# Altium project Collecteur.PrjPcb
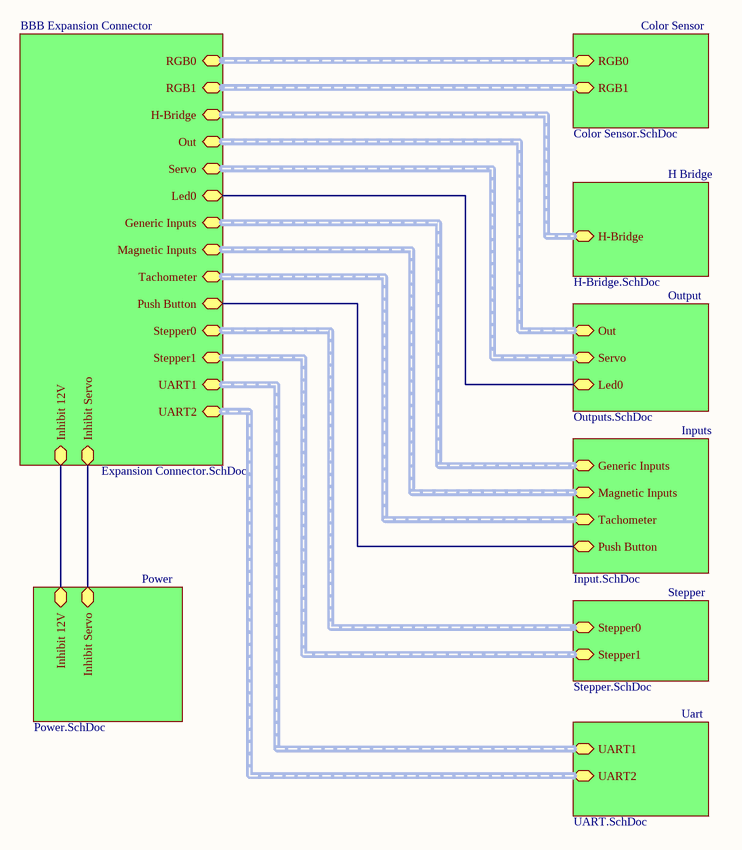
[diagram p0: Top.SchDoc]
5 sheets, 143 parts. Net scope: hierarchical (ports join the sheet entries above them; power ports are global).
Board file: Collecteur.PcbDoc
Sheets:
  Top.SchDoc
    Color Sensor = Color Sensor.SchDoc
    Stepper = Stepper.SchDoc
    Output = Outputs.SchDoc
    H Bridge = H-Bridge.SchDoc

## Sheet Top.SchDoc
size A4

### Sub-sheets
BBB Expansion Connector = Expansion Connector.SchDoc (file not in this document): Out (harness Outputs), Generic Inputs (harness Generic Inputs), RGB0 (harness RGB), H-Bridge (harness H-Bridge), RGB1 (harness RGB), Stepper0 (harness Stepper), Stepper1 (harness Stepper), Servo (harness Servo), Magnetic Inputs (harness Magnetic Inputs), Inhibit 12V, Inhibit Servo, Push Button, Tachometer (harness Tachometer), Led0, UART1 (harness Serial), UART2 (harness Serial)
Color Sensor = Color Sensor.SchDoc: RGB0 (harness RGB), RGB1 (harness RGB)
H Bridge = H-Bridge.SchDoc: H-Bridge (harness H-Bridge)
Inputs = Input.SchDoc (file not in this document): Generic Inputs (harness Generic Inputs), Magnetic Inputs (harness Magnetic Inputs), Push Button, Tachometer (harness Tachometer)
Output = Outputs.SchDoc: Out (harness Outputs), Servo (harness Servo), Led0
Power = Power.SchDoc (file not in this document): Inhibit 12V, Inhibit Servo
Stepper = Stepper.SchDoc: Stepper0 (harness Stepper), Stepper1 (harness Stepper)
Uart = UART.SchDoc (file not in this document): UART1 (harness Serial), UART2 (harness Serial)

### Nets
NetR99_1: sheet BBB Expansion Connector/Led0, sheet Output/Led0
(unnamed): sheet BBB Expansion Connector/Inhibit 12V, sheet Power/Inhibit 12V
(unnamed): sheet BBB Expansion Connector/Inhibit Servo, sheet Power/Inhibit Servo
(unnamed): sheet BBB Expansion Connector/Push Button, sheet Inputs/Push Button

### Buses and harness runs
harness sheet BBB Expansion Connector/Generic Inputs = sheet Inputs/Generic Inputs
harness sheet BBB Expansion Connector/H-Bridge = sheet H Bridge/H-Bridge
harness sheet BBB Expansion Connector/Magnetic Inputs = sheet Inputs/Magnetic Inputs
harness sheet BBB Expansion Connector/Out = sheet Output/Out
harness sheet BBB Expansion Connector/RGB0 = sheet Color Sensor/RGB0
harness sheet BBB Expansion Connector/RGB1 = sheet Color Sensor/RGB1
harness sheet BBB Expansion Connector/Servo = sheet Output/Servo
harness sheet BBB Expansion Connector/Stepper0 = sheet Stepper/Stepper0
harness sheet BBB Expansion Connector/Stepper1 = sheet Stepper/Stepper1
harness sheet BBB Expansion Connector/Tachometer = sheet Inputs/Tachometer
harness sheet BBB Expansion Connector/UART1 = sheet Uart/UART1
harness sheet BBB Expansion Connector/UART2 = sheet Uart/UART2

## Sheet Color Sensor.SchDoc
size A4
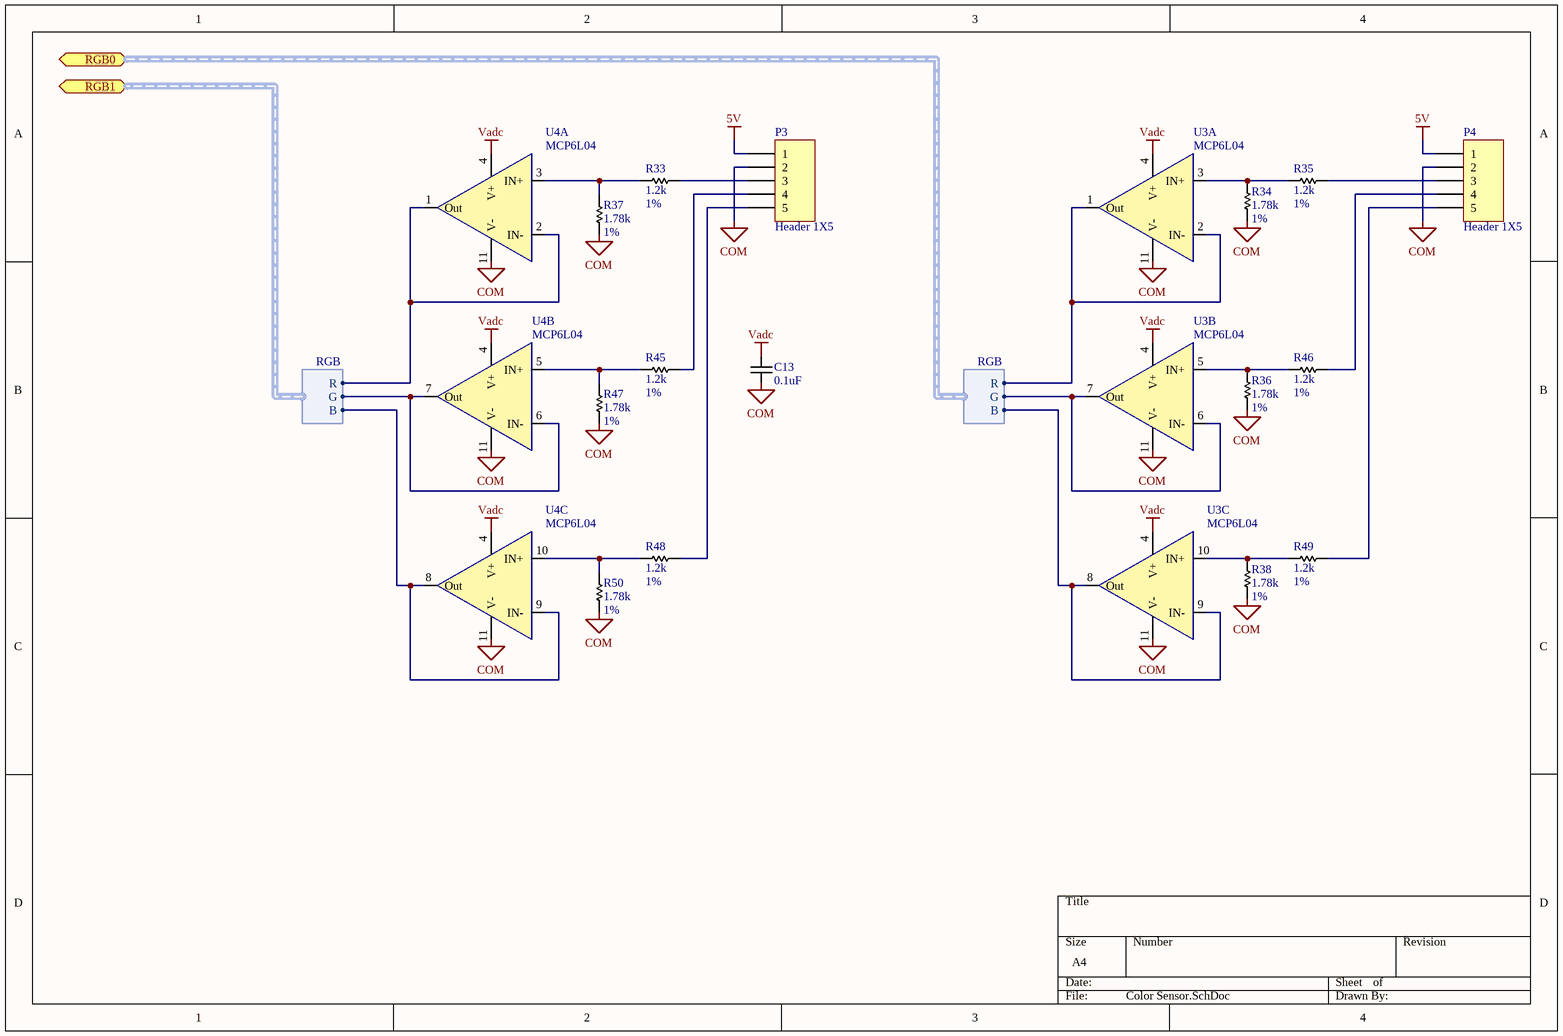
[diagram p1: Color Sensor.SchDoc]

### Parts
C13  value 0.1uF  [0805 - Cap Non-Polarized]  (hidden comment: Cap)
P3  Header 1X5  [Headers - 1x5 - Vertical - Lock]
P4  Header 1X5  [Headers - 1x5 - Vertical - Lock]
R33  value 1.2k  Tolerance: 1%  [0805 - Resistor]  (hidden comment: Res)
R34  value 1.78k  Tolerance: 1%  [0805 - Resistor]  (hidden comment: Res)
R35  value 1.2k  Tolerance: 1%  [0805 - Resistor]  (hidden comment: Res)
R36  value 1.78k  Tolerance: 1%  [0805 - Resistor]  (hidden comment: Res)
R37  value 1.78k  Tolerance: 1%  [0805 - Resistor]  (hidden comment: Res)
R38  value 1.78k  Tolerance: 1%  [0805 - Resistor]  (hidden comment: Res)
R45  value 1.2k  Tolerance: 1%  [0805 - Resistor]  (hidden comment: Res)
R46  value 1.2k  Tolerance: 1%  [0805 - Resistor]  (hidden comment: Res)
R47  value 1.78k  Tolerance: 1%  [0805 - Resistor]  (hidden comment: Res)
R48  value 1.2k  Tolerance: 1%  [0805 - Resistor]  (hidden comment: Res)
R49  value 1.2k  Tolerance: 1%  [0805 - Resistor]  (hidden comment: Res)
R50  value 1.78k  Tolerance: 1%  [0805 - Resistor]  (hidden comment: Res)
U3  MCP6L04  [SOIC14 - 0.150]  (parts A,B,C of 4)
U4  MCP6L04  [SOIC14 - 0.150]  (parts A,B,C of 4)

### Ports
RGB0 (harness RGB), RGB1 (harness RGB)

### Harnesses
RGB: R, G, B

### Nets
5V: P3.1 P4.1
COM: C13.2 P3.2 P4.2 R34.2 R36.2 R37.2 R38.2 R47.2 R50.2 U3.11(V-) U4.11(V-)
Vadc: C13.1 U3.4(V+) U4.4(V+)
NetP3_3: P3.3 R33.1
NetP3_4: P3.4 R45.1
NetP3_5: P3.5 R48.1
NetP4_3: P4.3 R35.1
NetP4_4: P4.4 R46.1
NetP4_5: P4.5 R49.1
NetR33_2: R33.2 R37.1 U4.3(IN+)
NetR34_1: R34.1 R35.2 U3.3(IN+)
NetR36_1: R36.1 R46.2 U3.5(IN+)
NetR38_1: R38.1 R49.2 U3.10(IN+)
NetR45_2: R45.2 R47.1 U4.5(IN+)
NetR48_2: R48.2 R50.1 U4.10(IN+)
NetU3_1: U3.1(Out) U3.2(IN-) ; port RGB0.R
NetU3_6: U3.6(IN-) U3.7(Out) ; port RGB0.G
NetU3_8: U3.8(Out) U3.9(IN-) ; port RGB0.B
NetU4_1: U4.1(Out) U4.2(IN-) ; port RGB1.R
NetU4_6: U4.6(IN-) U4.7(Out) ; port RGB1.G
NetU4_8: U4.8(Out) U4.9(IN-) ; port RGB1.B

### Library data of the parts
C13 = Cap-TDK-CGA-0.1uF-0805: CAP CER 0.1UF 100V 10% X7R 0805; Manufacturer: TDK; Manufacturer No: CGA4J2X7R2A104K125AA; Sub Category: 0805; Part Number: Cap-TDK-CGA-0.1uF-0805; Category: Capacitor; Pin count: 2; Package: 0805; Series: CGA; Supplier 1: Digi-Key; Supplier Part Number 1: 445-5827-1-ND; ComponentLink1URL: http://product.tdk.com/capacitor/mlcc/en/documents/mlcc_automotive_midvoltage_en.pdf; ComponentLink1Description: Datasheet; Creation Date: 2013-09-19 19:23:33; Created by: Pier-Yves; Tolerance: 10%; Height: 1.45mm; Voltage: 100V; Temperature: -55°C ~ 125°C
P3 P4 = Header-0.100-Vertical-Lock-1X5: CONN HEADER 5POS .100" STR TIN; Manufacturer: Molex Inc; Manufacturer No: 90136-1105; Sub Category: 100mils Vertical lock; Value: 5 pins; LatestRevisionDate: 17-Jul-2002; LatestRevisionNote: Re-released for DXP Platform.; Publisher: Altium Limited; Part Number: Header-0.100-Vertical-Lock-1X5; Category: Header; Pin count: 5; Series: C-Grid III 90136; Supplier 1: Digi-Key; Supplier Part Number 1: WM8216-ND; ComponentLink1URL: http://www.molex.com/pdm_docs/sd/901361105_sd.pdf; ComponentLink1Description: Datasheet; Creation Date: 2013-11-05 17:17:54; Created by: Pier-Yves; Height: 10.9mm
R33 R35 R45 R46 R48 R49 = Yagao-RC0805-1%-1.2k: RES 1.20K OHM 1/8W 1% 0805 SMD; Manufacturer: Yagao; Manufacturer No: RC0805FR-071K2L; Part Number: Yagao-RC0805-1%-1.2k; Category: Resistor; Sub Category: 0805 - 1%; Pin count: 2; Package: 0805; Series: RC0805; Supplier 1: Digi-Key; Supplier Part Number 1: 311-1.20KCRCT-ND; ComponentLink1URL: http://media.digikey.com/pdf/Data%20Sheets/Yageo%20PDFs/RC0805%20Pb%20Free.pdf; ComponentLink1Description: Datasheet; Creation Date: 2013-11-05 13:43:35; Created by: Pier-Yves; Power: 1/8W; Height: 0.6mm
R34 R36-R38 R47 R50 = Yagao-RC0805-1%-1.78k: RES 1.78K OHM 1/8W 1% 0805 SMD; Manufacturer: Yagao; Manufacturer No: RC0805FR-071K78L; Part Number: Yagao-RC0805-1%-1.78k; Category: Resistor; Sub Category: 0805 - 1%; Pin count: 2; Package: 0805; Series: RC0805; Supplier 1: Digi-Key; Supplier Part Number 1: 311-1.78KCRCT-ND; ComponentLink1URL: http://media.digikey.com/pdf/Data%20Sheets/Yageo%20PDFs/RC0805%20Pb%20Free.pdf; ComponentLink1Description: Datasheet; Creation Date: 2013-11-05 13:43:35; Created by: Pier-Yves; Power: 1/8W; Height: 0.6mm
U3 U4 = MCP6L04T: IC OPAMP GP 1MHZ RRO 14SOIC; Manufacturer: Microchip; Manufacturer No: MCP6L04T-E/SL; Value: ±6V; Current: 20mA; Part Number: MCP6L04T; Category: IC; Sub Category: OpAmp; Pin count: 14; Package: SOIC-14; Supplier 1: Digi-Key; Supplier Part Number 1: MCP6L04T-E/SLCT-ND; ComponentLink1URL: http://ww1.microchip.com/downloads/en/DeviceDoc/22140b.pdf; ComponentLink1Description: Datasheet; Creation Date: 2013-10-17 20:05:51; Created by: Pier-Yves; Height: 1,75mm; Temperature: -40°C ~ 125°C

## Sheet Stepper.SchDoc
size A4
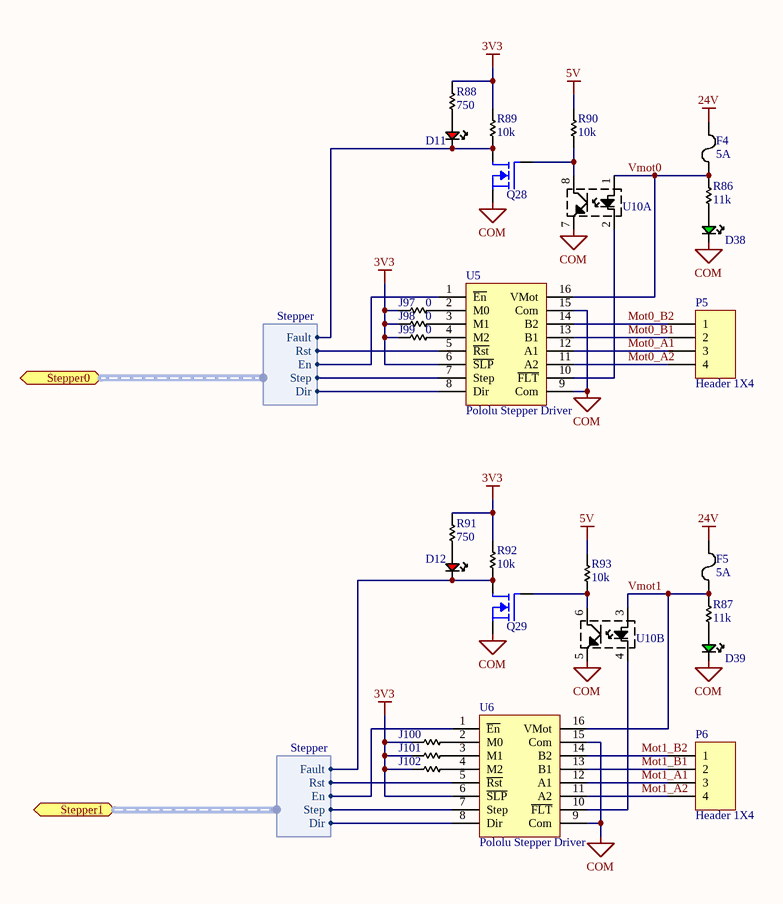
[diagram p2: Stepper.SchDoc]

### Parts
D11  Red  [0805 - Led Red]  (value not drawn)
D12  Red  [0805 - Led Red]  (value not drawn)
D38  Green  [0603 - Led Green]  (value not drawn)
D39  Green  [0603 - Led Green]  (value not drawn)
F4  value 5A  [Fuse - 1206]  (hidden comment: Fuse)
F5  value 5A  [Fuse - 1206]  (hidden comment: Fuse)
J97  value 0  [0805 - Resistor]  (hidden comment: Res)
J98  value 0  [0805 - Resistor]  (hidden comment: Res)
J99  value 0  [0805 - Resistor]  (hidden comment: Res)
J100  Res  [0805 - Resistor]  (value not drawn)
J101  Res  [0805 - Resistor]  (value not drawn)
J102  Res  [0805 - Resistor]  (value not drawn)
P5  Header 1X4  [Headers - 1x4 - Vertical - Lock]
P6  Header 1X4  [Headers - 1x4 - Vertical - Lock]
Q28  MOSFET_N  [SOT23-3]  (value not drawn)
Q29  MOSFET_N  [SOT23-3]  (value not drawn)
R86  value 11k  [0805 - Resistor]  (hidden comment: Res)
R87  value 11k  [0805 - Resistor]  (hidden comment: Res)
R88  value 750  [0805 - Resistor]  (hidden comment: Res)
R89  value 10k  [0805 - Resistor]  (hidden comment: Res)
R90  value 10k  [0805 - Resistor]  (hidden comment: Res)
R91  value 750  [0805 - Resistor]  (hidden comment: Res)
R92  value 10k  [0805 - Resistor]  (hidden comment: Res)
R93  value 10k  [0805 - Resistor]  (hidden comment: Res)
U5  Pololu Stepper Driver  [Pololu - DRV8825 - socket]
U6  Pololu Stepper Driver  [Pololu - DRV8825 - socket]
U10  LTV-827S-TA1  [8-SMD - GullWing]  (value not drawn)  (parts A,B of 2)

### Ports
Stepper0 (harness Stepper), Stepper1 (harness Stepper)

### Harnesses
Stepper: Dir, Step, En, Rst, Fault

### Nets
3V3: J97.2 J98.2 J99.2 J100.2 J101.2 J102.2 R88.2 R89.1 R91.2 R92.1 U5.6(~{SLP}) U6.6(~{SLP})
5V: R90.1 R93.1
24V: F4.1 F5.1
COM: D38.2(K) D39.2(K) Q28.2(S) Q29.2(S) U5.9(Com) U5.15(Com) U6.9(Com) U6.15(Com) U10.5(E2) U10.7(E1)
Mot0_A1: P5.3 U5.12(A1)
Mot0_A2: P5.4 U5.11(A2)
Mot0_B1: P5.2 U5.13(B1)
Mot0_B2: P5.1 U5.14(B2)
Mot1_A1: P6.3 U6.12(A1)
Mot1_A2: P6.4 U6.11(A2)
Mot1_B1: P6.2 U6.13(B1)
Mot1_B2: P6.1 U6.14(B2)
Vmot0: F4.2 R86.2 U5.16(VMot) U10.1(A1)
Vmot1: F5.2 R87.2 U6.16(VMot) U10.3(A2)
NetD11_1: D11.1(A) R88.1
NetD11_2: D11.2(K) Q28.3(D) R89.2 ; port Stepper0.Fault
NetD12_1: D12.1(A) R91.1
NetD12_2: D12.2(K) Q29.3(D) R92.2 ; port Stepper1.Fault
NetD38_1: D38.1(A) R86.1
NetD39_1: D39.1(A) R87.1
NetJ97_1: J97.1 U5.2(M0)
NetJ98_1: J98.1 U5.3(M1)
NetJ99_1: J99.1 U5.4(M2)
NetJ100_1: J100.1 U6.2(M0)
NetJ101_1: J101.1 U6.3(M1)
NetJ102_1: J102.1 U6.4(M2)
NetQ28_1: Q28.1(G) R90.2 U10.8(C1)
NetQ29_1: Q29.1(G) R93.2 U10.6(C2)
NetU5_1: U5.1(~{En}) ; port Stepper0.En
NetU5_5: U5.5(~{Rst}) ; port Stepper0.Rst
NetU5_7: U5.7(Step) ; port Stepper0.Step
NetU5_8: U5.8(Dir) ; port Stepper0.Dir
NetU5_10: U5.10(~{FLT}) U10.2(K1)
NetU6_1: U6.1(~{En}) ; port Stepper1.En
NetU6_5: U6.5(~{Rst}) ; port Stepper1.Rst
NetU6_7: U6.7(Step) ; port Stepper1.Step
NetU6_8: U6.8(Dir) ; port Stepper1.Dir
NetU6_10: U6.10(~{FLT}) U10.4(K2)

### Library data of the parts
D11 D12 = LED-Red-2mA-lowBrigthness-0805: LED 630NM RED WTR CLR 0805 SMD; Manufacturer: Rohm semiconductor; Manufacturer No: SML-211UTT86; Sub Category: 0805; Voltage: 1.8V; Current: 2mA; Part Number: LED-Red-2mA-lowBrigthness-0805; Category: LED; Pin count: 2; Package: 0805; Supplier 1: Digi-Key; Supplier Part Number 1: 511-1292-1-ND; ComponentLink1URL: http://rohmfs.rohm.com/en/products/databook/datasheet/opto/led/chip_mono/sml-21.pdf; ComponentLink1Description: Datasheet; Creation Date: 2013-11-19 15:30:55; Created by: Pier-Yves; Value: red; Height: 0.8mm
D38 D39 = LED-Green-2mA-lowBrigthness-0603: LED SMARTLED GREEN 570NM 0603; Manufacturer: OSRAM Opto Semiconductor; Manufacturer No: LG L29K-G2J1-24-Z; Sub Category: 0603; Value: 3.92 mcd; Voltage: 1.7V; Current: 2mA; Part Number: LED-Green-2mA-lowBrigthness-0603; Category: LED; Pin count: 2; Package: 0603; Series: SmartLED; Supplier 1: Digi-Key; Supplier Part Number 1: 475-2709-1-ND; ComponentLink1URL: http://catalog.osram-os.com/catalogue/catalogue.do;jsessionid=32CB61882C089EDD4B6D0A54E7E1F117?act=downloadFile&favOid=020000020000138e000100b6; ComponentLink1Description: Datasheet; Creation Date: 2013-11-17 11:13:55; Created by: Pier-Yves; Height: 0.65mm
F4 F5 = Fuse-1206-Bourns-Slow-SinglFuse_SF-1206S-5A: FUSE SLOW 24VDC 5A 1206; Manufacturer: Bourns Inc.; Manufacturer No: SF-1206S500-2; Sub Category: 1206 SlowBlow; Voltage: 63VDC; Part Number: Fuse-1206-Bourns-Slow-SinglFuse_SF-1206S-5A; Category: Fuse; Pin count: 2; Package: 1206; Series: SinglFuse SF-1206S; Supplier 1: Digi-Key; Supplier Part Number 1: SF-1206S500-2CT-ND; ComponentLink1URL: http://www.bourns.com/data/global/pdfs/sf1206s.pdf; ComponentLink1Description: Datasheet; Creation Date: 2013-11-18 20:50:29; Created by: Pier-Yves; Height: 0.6mm; Current: 5A; Temperature: -40°C ~ 105°C
J97-J99 = Jumper-0805: RES 0.0 OHM 1/8W JUMP 0805; Manufacturer: Stackpole electronic; Manufacturer No: RMCF0805ZT0R00; Sub Category: 0805; Current: 2A; Part Number: Jumper-0805; Category: Resistor; Pin count: 2; Package: 0805; Series: RMFC; Supplier 1: Digi-Key; Supplier Part Number 1: RMCF0805ZT0R00CT-ND; ComponentLink1URL: http://www.seielect.com/Catalog/SEI-RMCF_RMCP.pdf; ComponentLink1Description: Datasheet; Creation Date: 2013-09-21 02:33:24; Created by: Pier-Yves; Power: 1/8W; Height: 0.65mm
J100-J102 = Jumper-0805: RES 0.0 OHM 1/8W JUMP 0805; Manufacturer: Stackpole electronic; Manufacturer No: RMCF0805ZT0R00; Sub Category: 0805; Value: 0; Current: 2A; Part Number: Jumper-0805; Category: Resistor; Pin count: 2; Package: 0805; Series: RMFC; Supplier 1: Digi-Key; Supplier Part Number 1: RMCF0805ZT0R00CT-ND; ComponentLink1URL: http://www.seielect.com/Catalog/SEI-RMCF_RMCP.pdf; ComponentLink1Description: Datasheet; Creation Date: 2013-09-21 02:33:24; Created by: Pier-Yves; Power: 1/8W; Height: 0.65mm
P5 P6 = Header-0.100-Vertical-Lock-1X4: CONN HEADER 4POS .100" STR TIN; Manufacturer: Molex Inc; Manufacturer No: 90136-1104; Sub Category: 100mils Vertical lock; Value: 4 pins; LatestRevisionDate: 17-Jul-2002; LatestRevisionNote: Re-released for DXP Platform.; Publisher: Altium Limited; Part Number: Header-0.100-Vertical-Lock-1X4; Category: Header; Pin count: 4; Series: C-Grid III 90136; Supplier 1: Digi-Key; Supplier Part Number 1: WM8215-ND; ComponentLink1URL: http://www.molex.com/pdm_docs/sd/901361104_sd.pdf; ComponentLink1Description: Datasheet; Creation Date: 2013-11-05 17:17:54; Created by: Pier-Yves; Height: 10.9mm
Q28 Q29 = 2N7002: MosFET Channel-N SOT-23-3 3.3A; Part Number: 2N7002; Manufacturer: Vishay Siliconix; Manufacturer No: SI2304DDS-T1-GE3; Sub Category: MOSFET-N; Value: Channel N; Power: 1.7W; Voltage: 30V; Category: Transistor; Pin count: 3; Package: SOT-23-3; Series: ÉTrenchFET; Supplier 1: Digi-Key; Supplier Part Number 1: SI2304DDS-T1-GE3CT-ND; ComponentLink1URL: http://www.vishay.com/docs/65175/si2304dd.pdf; ComponentLink1Description: Datasheet; Creation Date: 2013-06-28 13:51:31; Created by: Pier-Yves; Current: 3.3A
R86 R87 = Yagao-RC0805-11k: RES 11K OHM 1/8W 5% 0805 SMD; Manufacturer: Yagao; Manufacturer No: RC0805JR-0711KL; Sub Category: 0805; Part Number: Yagao-RC0805-11k; Category: Resistor; Pin count: 2; Package: 0805; Series: RC0805; Supplier 1: Digi-Key; Supplier Part Number 1: 311-11KARCT-ND; ComponentLink1URL: http://media.digikey.com/pdf/Data%20Sheets/Yageo%20PDFs/RC0805%20Pb%20Free.pdf; ComponentLink1Description: Datasheet; Creation Date: 2013-06-28 03:21:03; Created by: Pier-Yves; Tolerance: 5%; Power: 1/8W; Height: 0.6mm
R88 R91 = Yagao-RC0805-750: RES 750 OHM 1/8W 5% 0805 SMD; Manufacturer: Yagao; Manufacturer No: RC0805JR-07750RL; Sub Category: 0805; Part Number: Yagao-RC0805-750; Category: Resistor; Pin count: 2; Package: 0805; Series: RC0805; Supplier 1: Digi-Key; Supplier Part Number 1: 311-750ARCT-ND; ComponentLink1URL: http://media.digikey.com/pdf/Data%20Sheets/Yageo%20PDFs/RC0805%20Pb%20Free.pdf; ComponentLink1Description: Datasheet; Creation Date: 2013-06-28 03:21:03; Created by: Pier-Yves; Tolerance: 5%; Power: 1/8W; Height: 0.6mm
R89 R90 R92 R93 = Yagao-RC0805-10k: RES 10K OHM 1/8W 5% 0805 SMD; Manufacturer: Yagao; Manufacturer No: RC0805JR-0710KL; Sub Category: 0805; Part Number: Yagao-RC0805-10k; Category: Resistor; Pin count: 2; Package: 0805; Series: RC0805; Supplier 1: Digi-Key; Supplier Part Number 1: 311-10KARCT-ND; ComponentLink1URL: http://media.digikey.com/pdf/Data%20Sheets/Yageo%20PDFs/RC0805%20Pb%20Free.pdf; ComponentLink1Description: Datasheet; Creation Date: 2013-06-28 03:21:03; Created by: Pier-Yves; Tolerance: 5%; Power: 1/8W; Height: 0.6mm
U5 U6 = Pololu-DRV8825-BiPolar-HighCurrent: Pololu 4 phase stepper driver 1/32 step; Manufacturer No: 2133; Value: 1.5A /phase; Voltage: 8.2V ~ 45V; Current: 1.5A; Part Number: Pololu-DRV8825-BiPolar-HighCurrent; Category: Module; Sub Category: Stepper Driver; Pin count: 16; Manufacturer: Pololu; Supplier 1: Pololu; Supplier Part Number 1: 2133; ComponentLink1URL: http://www.pololu.com/file/0J603/drv8824-drv8825-stepper-motor-driver-carrier-schematic-diagram.pdf; ComponentLink1Description: Datasheet; Creation Date: 2013-10-25 13:52:54; Created by: Pier-Yves; Temperature: –40°C to 150°C
U10 = LTV-827S-TA1: OPTOCOUPLER TRANS 5KVRMS 8SMD; Manufacturer: Lite-On; Power: 2ch; Voltage: 35V; Current: 50mA; Part Number: LTV-827S-TA1; Category: Optocoupler; Pin count: 8; Package: 8-SMD; Manufacturer No: LTV-827S-TA1; Supplier 1: Digi-Key; Supplier Part Number 1: 160-2040-1-ND; ComponentLink1URL: http://media.digikey.com/pdf/Data%20Sheets/Lite-On%20PDFs/LTV-817_827_847(M,S,S_TA1).pdf; ComponentLink1Description: Datasheet; Creation Date: 2013-11-19 14:59:51; Created by: Pier-Yves; Height: 3.5mm

## Sheet Outputs.SchDoc
size A4
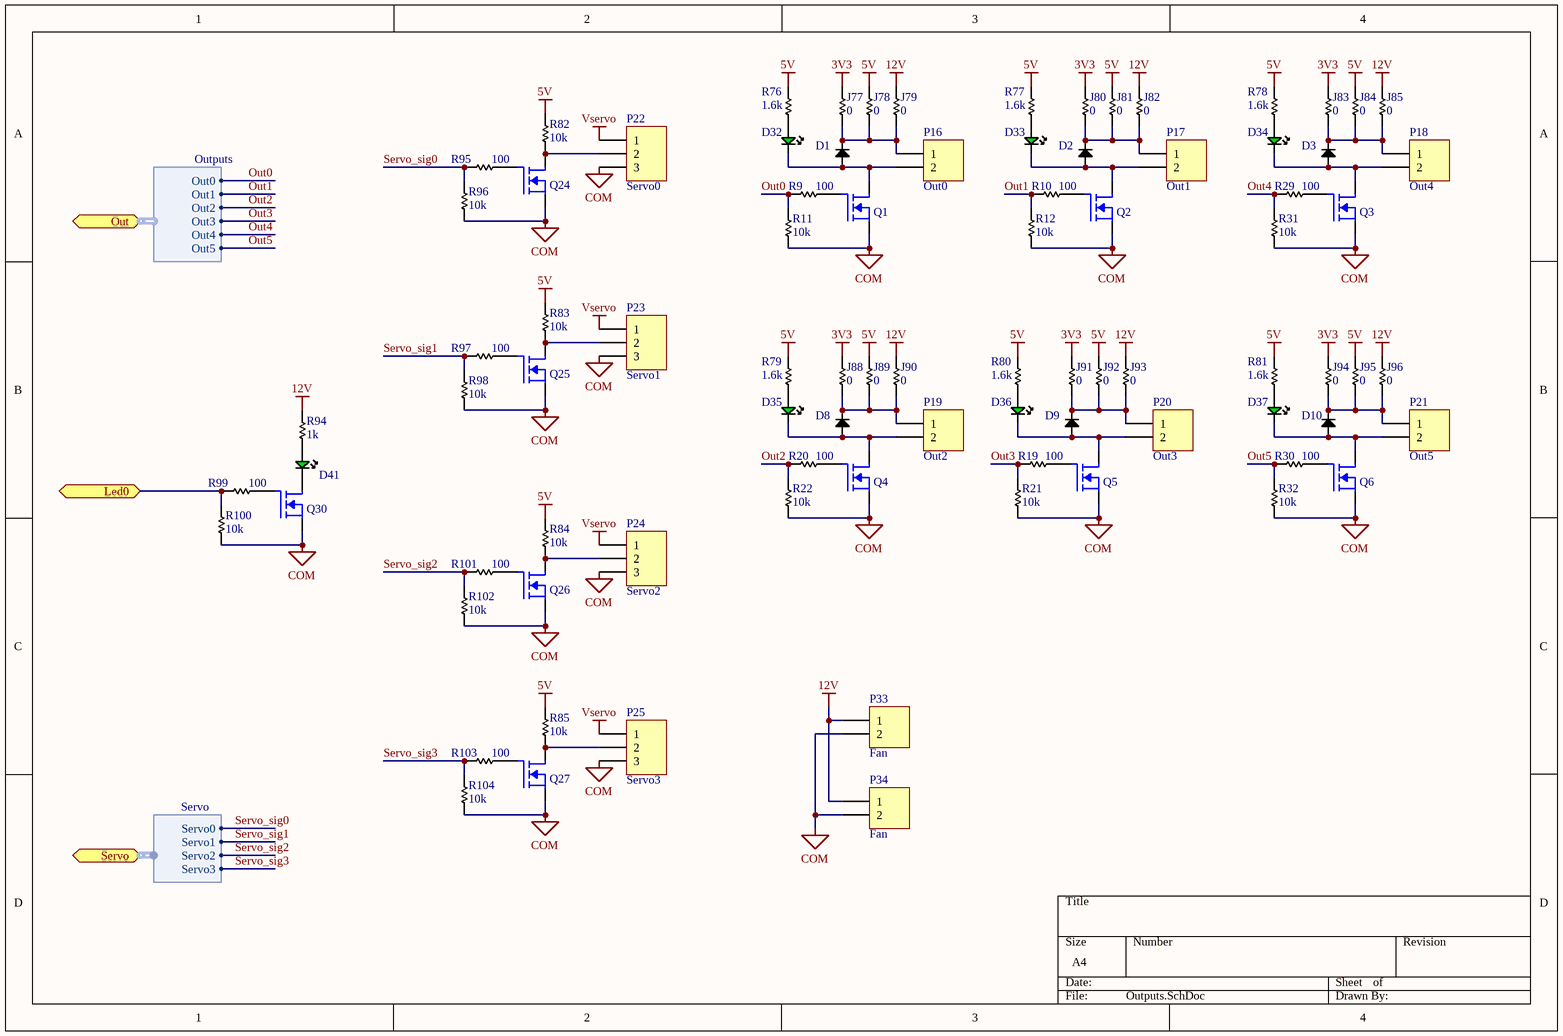
[diagram p3: Outputs.SchDoc]

### Parts
D1  Diode  [DOS-214AC (SMA)]  (value not drawn)
D2  Diode  [DOS-214AC (SMA)]  (value not drawn)
D3  Diode  [DOS-214AC (SMA)]  (value not drawn)
D8  Diode  [DOS-214AC (SMA)]  (value not drawn)
D9  Diode  [DOS-214AC (SMA)]  (value not drawn)
D10  Diode  [DOS-214AC (SMA)]  (value not drawn)
D32  Green  [0603 - Led Green]  (value not drawn)
D33  Green  [0603 - Led Green]  (value not drawn)
D34  Green  [0603 - Led Green]  (value not drawn)
D35  Green  [0603 - Led Green]  (value not drawn)
D36  Green  [0603 - Led Green]  (value not drawn)
D37  Green  [0603 - Led Green]  (value not drawn)
D41  Green  [0805 - Led Green]  (value not drawn)
J77  value 0  [0805 - Resistor]  (hidden comment: Res)
J78  value 0  [0805 - Resistor]  (hidden comment: Res)
J79  value 0  [0805 - Resistor]  (hidden comment: Res)
J80  value 0  [0805 - Resistor]  (hidden comment: Res)
J81  value 0  [0805 - Resistor]  (hidden comment: Res)
J82  value 0  [0805 - Resistor]  (hidden comment: Res)
J83  value 0  [0805 - Resistor]  (hidden comment: Res)
J84  value 0  [0805 - Resistor]  (hidden comment: Res)
J85  value 0  [0805 - Resistor]  (hidden comment: Res)
J88  value 0  [0805 - Resistor]  (hidden comment: Res)
J89  value 0  [0805 - Resistor]  (hidden comment: Res)
J90  value 0  [0805 - Resistor]  (hidden comment: Res)
J91  value 0  [0805 - Resistor]  (hidden comment: Res)
J92  value 0  [0805 - Resistor]  (hidden comment: Res)
J93  value 0  [0805 - Resistor]  (hidden comment: Res)
J94  value 0  [0805 - Resistor]  (hidden comment: Res)
J95  value 0  [0805 - Resistor]  (hidden comment: Res)
J96  value 0  [0805 - Resistor]  (hidden comment: Res)
P16  Out0  [Headers - 1x2 - Vertical - Lock]
P17  Out1  [Headers - 1x2 - Vertical - Lock]
P18  Out4  [Headers - 1x2 - Vertical - Lock]
P19  Out2  [Headers - 1x2 - Vertical - Lock]
P20  Out3  [Headers - 1x2 - Vertical - Lock]
P21  Out5  [Headers - 1x2 - Vertical - Lock]
P22  Servo0  [Headers - 1x3 - Vertical - Lock]
P23  Servo1  [Headers - 1x3 - Vertical - Lock]
P24  Servo2  [Headers - 1x3 - Vertical - Lock]
P25  Servo3  [Headers - 1x3 - Vertical - Lock]
P33  Fan  [Headers - 1x2 - Vertical - Lock]
P34  Fan  [Headers - 1x2 - Vertical - Lock]
Q1  MOSFET_N  [SOT23-3]  (value not drawn)
Q2  MOSFET_N  [SOT23-3]  (value not drawn)
Q3  MOSFET_N  [SOT23-3]  (value not drawn)
Q4  MOSFET_N  [SOT23-3]  (value not drawn)
Q5  MOSFET_N  [SOT23-3]  (value not drawn)
Q6  MOSFET_N  [SOT23-3]  (value not drawn)
Q24  MOSFET_N  [SOT23-3]  (value not drawn)
Q25  MOSFET_N  [SOT23-3]  (value not drawn)
Q26  MOSFET_N  [SOT23-3]  (value not drawn)
Q27  MOSFET_N  [SOT23-3]  (value not drawn)
Q30  MOSFET_N  [SOT23-3]  (value not drawn)
R9  value 100  [0805 - Resistor]  (hidden comment: Res)
R10  value 100  [0805 - Resistor]  (hidden comment: Res)
R11  value 10k  [0805 - Resistor]  (hidden comment: Res)
R12  value 10k  [0805 - Resistor]  (hidden comment: Res)
R19  value 100  [0805 - Resistor]  (hidden comment: Res)
R20  value 100  [0805 - Resistor]  (hidden comment: Res)
R21  value 10k  [0805 - Resistor]  (hidden comment: Res)
R22  value 10k  [0805 - Resistor]  (hidden comment: Res)
R29  value 100  [0805 - Resistor]  (hidden comment: Res)
R30  value 100  [0805 - Resistor]  (hidden comment: Res)
R31  value 10k  [0805 - Resistor]  (hidden comment: Res)
R32  value 10k  [0805 - Resistor]  (hidden comment: Res)
R76  value 1.6k  [0805 - Resistor]  (hidden comment: Res)
R77  value 1.6k  [0805 - Resistor]  (hidden comment: Res)
R78  value 1.6k  [0805 - Resistor]  (hidden comment: Res)
R79  value 1.6k  [0805 - Resistor]  (hidden comment: Res)
R80  value 1.6k  [0805 - Resistor]  (hidden comment: Res)
R81  value 1.6k  [0805 - Resistor]  (hidden comment: Res)
R82  value 10k  [0805 - Resistor]  (hidden comment: Res)
R83  value 10k  [0805 - Resistor]  (hidden comment: Res)
R84  value 10k  [0805 - Resistor]  (hidden comment: Res)
R85  value 10k  [0805 - Resistor]  (hidden comment: Res)
R94  value 1k  [0805 - Resistor]  (hidden comment: Res)
R95  value 100  [0805 - Resistor]  (hidden comment: Res)
R96  value 10k  [0805 - Resistor]  (hidden comment: Res)
R97  value 100  [0805 - Resistor]  (hidden comment: Res)
R98  value 10k  [0805 - Resistor]  (hidden comment: Res)
R99  value 100  [0805 - Resistor]  (hidden comment: Res)
R100  value 10k  [0805 - Resistor]  (hidden comment: Res)
R101  value 100  [0805 - Resistor]  (hidden comment: Res)
R102  value 10k  [0805 - Resistor]  (hidden comment: Res)
R103  value 100  [0805 - Resistor]  (hidden comment: Res)
R104  value 10k  [0805 - Resistor]  (hidden comment: Res)

### Ports
Led0, Out (harness Outputs), Servo (harness Servo)

### Harnesses
Outputs: Out0, Out1, Out2, Out3, Out4, Out5
Servo: Servo0, Servo1, Servo2, Servo3

### Nets
3V3: J77.2 J80.2 J83.2 J88.2 J91.2 J94.2
5V: J78.2 J81.2 J84.2 J89.2 J92.2 J95.2 R76.2 R77.2 R78.2 R79.2 R80.2 R81.2 R82.2 R83.2 R84.2 R85.2
12V: J79.2 J82.2 J85.2 J90.2 J93.2 J96.2 P33.1 P34.1 R94.1
COM: P22.3 P23.3 P24.3 P25.3 P33.2 P34.2 Q1.2(S) Q2.2(S) Q3.2(S) Q4.2(S) Q5.2(S) Q6.2(S) Q24.2(S) Q25.2(S) Q26.2(S) Q27.2(S) Q30.2(S) R11.1 R12.1 R21.1 R22.1 R31.1 R32.1 R96.1 R98.1 R100.1 R102.1 R104.1
Vservo: P22.1 P23.1 P24.1 P25.1
Out0: R9.1 R11.2 ; port Out.Out0
Out1: R10.1 R12.2 ; port Out.Out1
Out2: R20.1 R22.2 ; port Out.Out2
Out3: R19.1 R21.2 ; port Out.Out3
Out4: R29.1 R31.2 ; port Out.Out4
Out5: R30.1 R32.2 ; port Out.Out5
Servo_sig0: R95.1 R96.2 ; port Servo.Servo0
Servo_sig1: R97.1 R98.2 ; port Servo.Servo1
Servo_sig2: R101.1 R102.2 ; port Servo.Servo2
Servo_sig3: R103.1 R104.2 ; port Servo.Servo3
NetD1_1: D1.1(A) D32.2(K) P16.2 Q1.3(D)
NetD1_2: D1.2(K) J77.1 J78.1 J79.1 P16.1
NetD2_1: D2.1(A) D33.2(K) P17.2 Q2.3(D)
NetD2_2: D2.2(K) J80.1 J81.1 J82.1 P17.1
NetD3_1: D3.1(A) D34.2(K) P18.2 Q3.3(D)
NetD3_2: D3.2(K) J83.1 J84.1 J85.1 P18.1
NetD8_1: D8.1(A) D35.2(K) P19.2 Q4.3(D)
NetD8_2: D8.2(K) J88.1 J89.1 J90.1 P19.1
NetD9_1: D9.1(A) D36.2(K) P20.2 Q5.3(D)
NetD9_2: D9.2(K) J91.1 J92.1 J93.1 P20.1
NetD10_1: D10.1(A) D37.2(K) P21.2 Q6.3(D)
NetD10_2: D10.2(K) J94.1 J95.1 J96.1 P21.1
NetD32_1: D32.1(A) R76.1
NetD33_1: D33.1(A) R77.1
NetD34_1: D34.1(A) R78.1
NetD35_1: D35.1(A) R79.1
NetD36_1: D36.1(A) R80.1
NetD37_1: D37.1(A) R81.1
NetD41_1: D41.1(A) R94.2
NetD41_2: D41.2(K) Q30.3(D)
NetP22_2: P22.2 Q24.3(D) R82.1
NetP23_2: P23.2 Q25.3(D) R83.1
NetP24_2: P24.2 Q26.3(D) R84.1
NetP25_2: P25.2 Q27.3(D) R85.1
NetQ1_1: Q1.1(G) R9.2
NetQ2_1: Q2.1(G) R10.2
NetQ3_1: Q3.1(G) R29.2
NetQ4_1: Q4.1(G) R20.2
NetQ5_1: Q5.1(G) R19.2
NetQ6_1: Q6.1(G) R30.2
NetQ24_1: Q24.1(G) R95.2
NetQ25_1: Q25.1(G) R97.2
NetQ26_1: Q26.1(G) R101.2
NetQ27_1: Q27.1(G) R103.2
NetQ30_1: Q30.1(G) R99.2
NetR99_1: R99.1 R100.2 ; port Led0

### Library data of the parts
D1-D3 D8-D10 = S1M-13-F: DIODE GEN PURPOSE 1000V 1A SMA; Manufacturer: Diodes Inc.; Manufacturer No: BAS21LT3G; Sub Category: Single; Voltage: 1.1V @ 1A; Part Number: S1M-13-F; Category: Diode; Pin count: 2; Package: SMA; Supplier 1: Digi-Key; Supplier Part Number 1: S1M-FDICT-ND; ComponentLink1URL: http://www.diodes.com/datasheets/ds16003.pdf; ComponentLink1Description: Datasheet; Creation Date: 2013-10-21 20:14:01; Created by: Pier-Yves; Value: SMA; Current: 1A; Temperature: -55°C ~ 150°C
D32-D37 = LED-Green-2mA-lowBrigthness-0603: as D38 on sheet Stepper; Part Number: LED-Green-2mA-lowBrigthness-0603; Category: LED; Pin count: 2; Package: 0603; Series: SmartLED; Supplier 1: Digi-Key; Supplier Part Number 1: 475-2709-1-ND; ComponentLink1URL: http://catalog.osram-os.com/catalogue/catalogue.do;jsessionid=32CB61882C089EDD4B6D0A54E7E1F117?act=downloadFile&favOid=020000020000138e000100b6; ComponentLink1Description: Datasheet; Creation Date: 2013-11-17 11:13:55; Created by: Pier-Yves; Height: 0.65mm
D41 = LED-Green-lowBrigthness-0805: Led Green 0805 Low Brightness - 10mA; Manufacturer: Lite-On inc.; Manufacturer No: LTST-C170GKT; Sub Category: 0805; Value: 6mcd; Voltage: 2.1V; Part Number: LED-Green-lowBrigthness-0805; Category: LED; Pin count: 2; Package: 0805; Supplier 1: Digi-Key; Supplier Part Number 1: 160-1179-1-ND; ComponentLink1URL: http://media.digikey.com/pdf/Data%20Sheets/Lite-On%20PDFs/LTST-C170GKT.pdf; ComponentLink1Description: Datasheet; Created by: Pier-Yves; Height: 1.10mm; Current: 10mA
J77-J85 J88-J96 = Jumper-0805: as J97 on sheet Stepper; Part Number: Jumper-0805; Category: Resistor; Pin count: 2; Package: 0805; Series: RMFC; Supplier 1: Digi-Key; Supplier Part Number 1: RMCF0805ZT0R00CT-ND; ComponentLink1URL: http://www.seielect.com/Catalog/SEI-RMCF_RMCP.pdf; ComponentLink1Description: Datasheet; Creation Date: 2013-09-21 02:33:24; Created by: Pier-Yves; Power: 1/8W; Height: 0.65mm
P16-P21 P33 P34 = Header-0.100-Vertical-Lock-1X2: CONN HEADER 2POS .100" STR TIN; Manufacturer: Molex Inc; Manufacturer No: 0901361102; Sub Category: 100mils Vertical lock; Value: 2 pins; LatestRevisionDate: 17-Jul-2002; LatestRevisionNote: Re-released for DXP Platform.; Publisher: Altium Limited; Part Number: Header-0.100-Vertical-Lock-1X2; Category: Header; Pin count: 2; Series: C-Grid III 90136; Supplier 1: Digi-Key; Supplier Part Number 1: WM8213-ND; ComponentLink1URL: http://www.molex.com/pdm_docs/sd/901361102_sd.pdf; ComponentLink1Description: Datasheet; Creation Date: 2013-11-05 17:17:54; Created by: Pier-Yves; Height: 10.9mm
P22-P25 = Header-0.100-Vertical-Lock-1X3: CONN HEADER 3POS .100" STR TIN; Manufacturer: Molex Inc; Manufacturer No: 0901361103; Sub Category: 100mils Vertical lock; Value: 3 pins; LatestRevisionDate: 17-Jul-2002; LatestRevisionNote: Re-released for DXP Platform.; Publisher: Altium Limited; Part Number: Header-0.100-Vertical-Lock-1X3; Category: Header; Pin count: 3; Series: C-Grid III 90136; Supplier 1: Digi-Key; Supplier Part Number 1: WM8214-ND; ComponentLink1URL: http://www.molex.com/pdm_docs/sd/901361103_sd.pdf; ComponentLink1Description: Datasheet; Creation Date: 2013-11-05 17:17:54; Created by: Pier-Yves; Height: 10.9mm
Q1-Q6 Q24-Q27 Q30 = 2N7002: as Q28 on sheet Stepper; Category: Transistor; Pin count: 3; Package: SOT-23-3; Series: ÉTrenchFET; Supplier 1: Digi-Key; Supplier Part Number 1: SI2304DDS-T1-GE3CT-ND; ComponentLink1URL: http://www.vishay.com/docs/65175/si2304dd.pdf; ComponentLink1Description: Datasheet; Creation Date: 2013-06-28 13:51:31; Created by: Pier-Yves; Current: 3.3A
R9 R10 R19 R20 R29 R30 R95 R97 R99 R101 R103 = Yagao-RC0805-100: RES 100 OHM 1/8W 5% 0805 SMD; Manufacturer: Yagao; Manufacturer No: RC0805JR-07100RL; Sub Category: 0805; Part Number: Yagao-RC0805-100; Category: Resistor; Pin count: 2; Package: 0805; Series: RC0805; Supplier 1: Digi-Key; Supplier Part Number 1: 311-100ARCT-ND; ComponentLink1URL: http://media.digikey.com/pdf/Data%20Sheets/Yageo%20PDFs/RC0805%20Pb%20Free.pdf; ComponentLink1Description: Datasheet; Creation Date: 2013-06-28 03:21:03; Created by: Pier-Yves; Tolerance: 5%; Power: 1/8W; Height: 0.6mm
R11 R12 R21 R22 R31 R32 R82-R85 R96 R98 R100 R102 R104 = Yagao-RC0805-10k: as R89 on sheet Stepper; Part Number: Yagao-RC0805-10k; Category: Resistor; Pin count: 2; Package: 0805; Series: RC0805; Supplier 1: Digi-Key; Supplier Part Number 1: 311-10KARCT-ND; ComponentLink1URL: http://media.digikey.com/pdf/Data%20Sheets/Yageo%20PDFs/RC0805%20Pb%20Free.pdf; ComponentLink1Description: Datasheet; Creation Date: 2013-06-28 03:21:03; Created by: Pier-Yves; Tolerance: 5%; Power: 1/8W; Height: 0.6mm
R76-R81 = Yagao-RC0805-1.6k: RES 1.6K OHM 1/8W 5% 0805 SMD; Manufacturer: Yagao; Manufacturer No: RC0805JR-071K6L; Sub Category: 0805; Part Number: Yagao-RC0805-1.6k; Category: Resistor; Pin count: 2; Package: 0805; Series: RC0805; Supplier 1: Digi-Key; Supplier Part Number 1: 311-1.6KARCT-ND; ComponentLink1URL: http://media.digikey.com/pdf/Data%20Sheets/Yageo%20PDFs/RC0805%20Pb%20Free.pdf; ComponentLink1Description: Datasheet; Creation Date: 2013-06-28 03:21:03; Created by: Pier-Yves; Tolerance: 5%; Power: 1/8W; Height: 0.6mm
R94 = Yagao-RC0805-1k: RES 1.0K OHM 1/8W 5% 0805 SMD; Manufacturer: Yagao; Manufacturer No: RC0805JR-071KL; Sub Category: 0805; Part Number: Yagao-RC0805-1k; Category: Resistor; Pin count: 2; Package: 0805; Series: RC0805; Supplier 1: Digi-Key; Supplier Part Number 1: 311-1.0KARCT-ND; ComponentLink1URL: http://media.digikey.com/pdf/Data%20Sheets/Yageo%20PDFs/RC0805%20Pb%20Free.pdf; ComponentLink1Description: Datasheet; Creation Date: 2013-06-28 03:21:03; Created by: Pier-Yves; Tolerance: 5%; Power: 1/8W; Height: 0.6mm

## Sheet H-Bridge.SchDoc
size A4
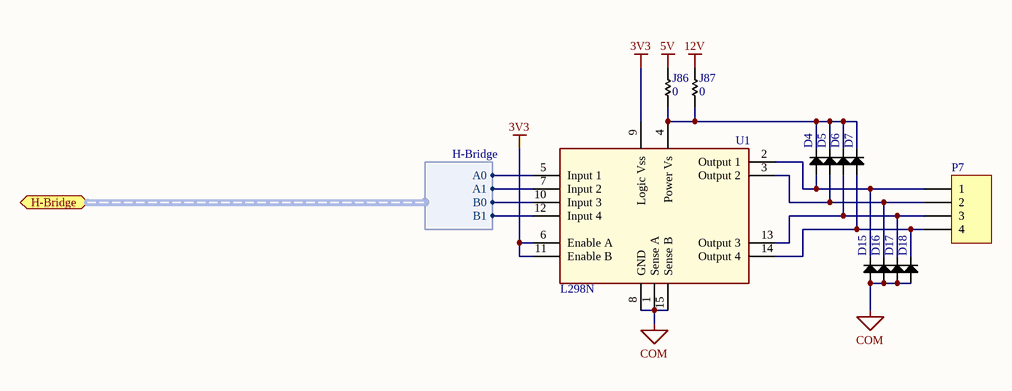
[diagram p4: H-Bridge.SchDoc]

### Parts
D4  Diode  [DOS-214AC (SMA)]  (value not drawn)
D5  Diode  [DOS-214AC (SMA)]  (value not drawn)
D6  Diode  [DOS-214AC (SMA)]  (value not drawn)
D7  Diode  [DOS-214AC (SMA)]  (value not drawn)
D15  Diode  [DOS-214AC (SMA)]  (value not drawn)
D16  Diode  [DOS-214AC (SMA)]  (value not drawn)
D17  Diode  [DOS-214AC (SMA)]  (value not drawn)
D18  Diode  [DOS-214AC (SMA)]  (value not drawn)
J86  value 0  [0805 - Resistor]  (hidden comment: Res)
J87  value 0  [0805 - Resistor]  (hidden comment: Res)
P7  Header 1X4  [Headers - 1x4 - Vertical - Lock]  (value not drawn)
U1  L298N  [Multiwatt_15]

### Ports
H-Bridge (harness H-Bridge)

### Harnesses
H-Bridge: A0, A1, B0, B1

### Nets
3V3: U1.6(Enable_A) U1.9(Logic_Vss) U1.11(Enable_B)
5V: J86.2
12V: J87.2
COM: D15.1(A) D16.1(A) D17.1(A) D18.1(A) U1.1(Sense_A) U1.8(GND) U1.15(Sense_B)
NetD4_1: D4.1(A) D15.2(K) P7.1 U1.2(Output_1)
NetD4_2: D4.2(K) D5.2(K) D6.2(K) D7.2(K) J86.1 J87.1 U1.4(Power_Vs)
NetD5_1: D5.1(A) D16.2(K) P7.2 U1.3(Output_2)
NetD6_1: D6.1(A) D17.2(K) P7.3 U1.13(Output_3)
NetD7_1: D7.1(A) D18.2(K) P7.4 U1.14(Output_4)
NetU1_5: U1.5(Input_1) ; port H-Bridge.A0
NetU1_7: U1.7(Input_2) ; port H-Bridge.A1
NetU1_10: U1.10(Input_3) ; port H-Bridge.B0
NetU1_12: U1.12(Input_4) ; port H-Bridge.B1

### Library data of the parts
D4-D7 D15-D18 = S1M-13-F: as D1 on sheet Outputs; Part Number: S1M-13-F; Category: Diode; Pin count: 2; Package: SMA; Supplier 1: Digi-Key; Supplier Part Number 1: S1M-FDICT-ND; ComponentLink1URL: http://www.diodes.com/datasheets/ds16003.pdf; ComponentLink1Description: Datasheet; Creation Date: 2013-10-21 20:14:01; Created by: Pier-Yves; Value: SMA; Current: 1A; Temperature: -55°C ~ 150°C
J86 J87 = Jumper-0805: as J97 on sheet Stepper; Part Number: Jumper-0805; Category: Resistor; Pin count: 2; Package: 0805; Series: RMFC; Supplier 1: Digi-Key; Supplier Part Number 1: RMCF0805ZT0R00CT-ND; ComponentLink1URL: http://www.seielect.com/Catalog/SEI-RMCF_RMCP.pdf; ComponentLink1Description: Datasheet; Creation Date: 2013-09-21 02:33:24; Created by: Pier-Yves; Power: 1/8W; Height: 0.65mm
P7 = Header-0.100-Vertical-Lock-1X4: as P5 on sheet Stepper; LatestRevisionDate: 17-Jul-2002; LatestRevisionNote: Re-released for DXP Platform.; Publisher: Altium Limited; Part Number: Header-0.100-Vertical-Lock-1X4; Category: Header; Pin count: 4; Series: C-Grid III 90136; Supplier 1: Digi-Key; Supplier Part Number 1: WM8215-ND; ComponentLink1URL: http://www.molex.com/pdm_docs/sd/901361104_sd.pdf; ComponentLink1Description: Datasheet; Creation Date: 2013-11-05 17:17:54; Created by: Pier-Yves; Height: 10.9mm
U1 = L298N: IC BRIDGE DRIVER PAR 15MULTIWATT; Manufacturer: STMicroelectronics; Sub Category: Bridges; Power: 25; Voltage: 4.8 V ~ 46 V; Current: 2A; Date: 2012-10-10; Part Number: L298N; Category: IC; Pin count: 15; Package: Multiwatt15; Manufacturer No: L298N; Supplier 1: Digi-Key; Supplier Part Number 1: 497-1395-5-ND; ComponentLink1URL: http://www.st.com/web/en/resource/technical/document/datasheet/CD00000240.pdf; ComponentLink1Description: Datasheet; Created by: Pier-Yves; Temperature: -25°C ~ 130°C

## Nets that join several sheets
3V3: Stepper (12 pins), Outputs (6 pins), H-Bridge (U1.6 U1.9 U1.11)
5V: Color Sensor (P3.1 P4.1), Stepper (R90.1 R93.1), Outputs (16 pins), H-Bridge (J86.2)
12V: Outputs (9 pins), H-Bridge (J87.2)
COM: Color Sensor (11 pins), Stepper (10 pins), Outputs (28 pins), H-Bridge (7 pins)